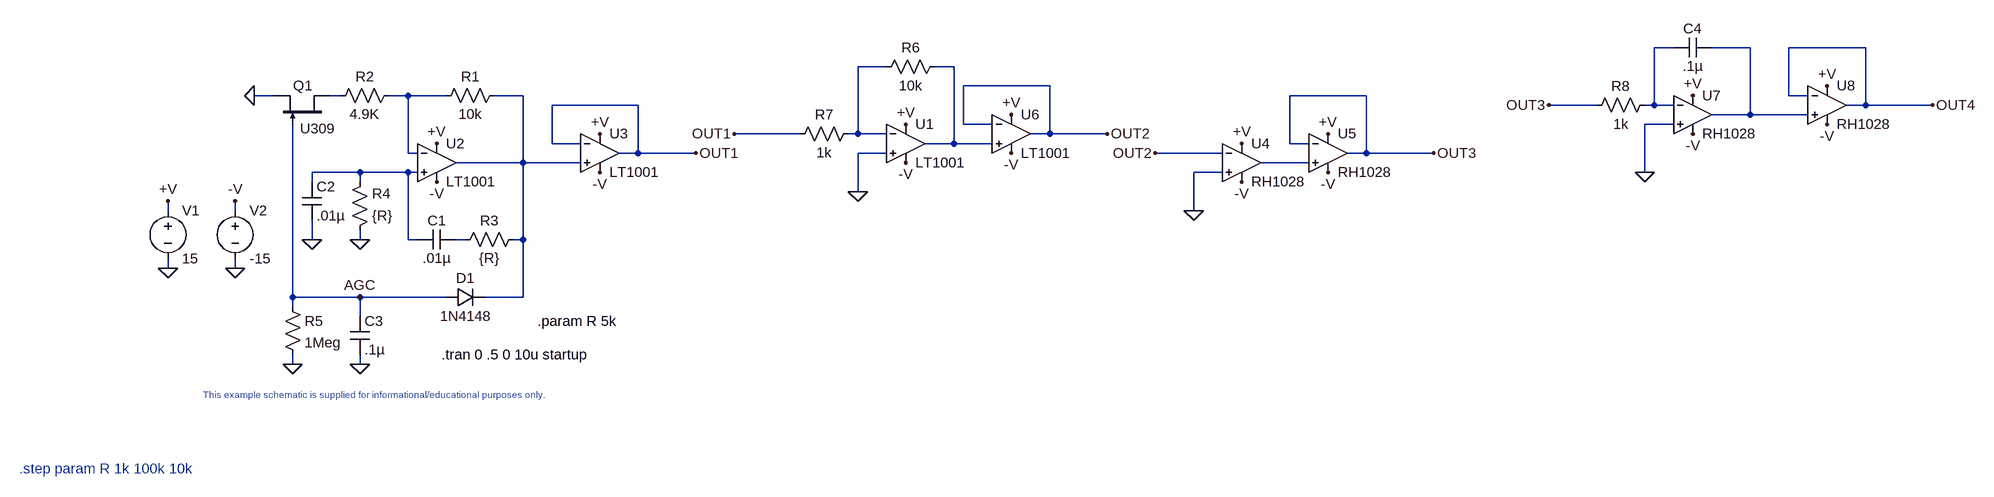
[diagram p0: schematic Puente Wien.asc]
Puente Wien.asc, the LTspice schematic file:
Version 4.1
SHEET 1 3160 1108
WIRE 2272 48 2240 48
WIRE 2400 48 2336 48
WIRE 2592 48 2464 48
WIRE 960 80 912 80
WIRE 1072 80 1040 80
WIRE 1232 112 1088 112
WIRE -112 128 -144 128
WIRE 0 128 -16 128
WIRE 112 128 80 128
WIRE 176 128 112 128
WIRE 304 128 256 128
WIRE 1760 128 1632 128
WIRE 2464 128 2464 48
WIRE 2496 128 2464 128
WIRE 496 144 352 144
WIRE 2144 144 2064 144
WIRE 2240 144 2240 48
WIRE 2240 144 2224 144
WIRE 2272 144 2240 144
WIRE 2592 144 2592 48
WIRE 2592 144 2560 144
WIRE 2704 144 2592 144
WIRE 2400 160 2400 48
WIRE 2400 160 2336 160
WIRE 2496 160 2400 160
WIRE 1088 176 1088 112
WIRE 1136 176 1088 176
WIRE 2272 176 2224 176
WIRE 816 192 656 192
WIRE 912 192 912 80
WIRE 912 192 896 192
WIRE 960 192 912 192
WIRE 1232 192 1232 112
WIRE 1232 192 1200 192
WIRE 1328 192 1232 192
WIRE 352 208 352 144
WIRE 400 208 352 208
WIRE 1072 208 1072 80
WIRE 1072 208 1024 208
WIRE 1136 208 1072 208
WIRE 1632 208 1632 128
WIRE 1664 208 1632 208
WIRE 112 224 112 128
WIRE 128 224 112 224
WIRE 496 224 496 144
WIRE 496 224 464 224
WIRE 592 224 496 224
WIRE 960 224 912 224
WIRE 1520 224 1408 224
WIRE 1760 224 1760 128
WIRE 1760 224 1728 224
WIRE 1872 224 1760 224
WIRE 304 240 304 128
WIRE 304 240 192 240
WIRE 400 240 304 240
WIRE 1664 240 1584 240
WIRE 32 256 -48 256
WIRE 112 256 32 256
WIRE 128 256 112 256
WIRE 1520 256 1472 256
WIRE 2224 256 2224 176
WIRE -48 272 -48 256
WIRE 32 272 32 256
WIRE 912 288 912 224
WIRE -288 320 -288 304
WIRE -176 320 -176 304
WIRE 1472 320 1472 256
WIRE -48 368 -48 336
WIRE 32 368 32 352
WIRE 112 368 112 256
WIRE 128 368 112 368
WIRE 208 368 192 368
WIRE 304 368 304 240
WIRE 304 368 288 368
WIRE -288 416 -288 400
WIRE -176 416 -176 400
WIRE -80 464 -80 176
WIRE 32 464 -80 464
WIRE 176 464 32 464
WIRE 304 464 304 368
WIRE 304 464 240 464
WIRE -80 480 -80 464
WIRE 32 496 32 464
WIRE -80 576 -80 560
WIRE 32 576 32 560
FLAG 160 208 +V
FLAG 160 272 -V
FLAG -288 304 +V
FLAG -176 416 0
FLAG -288 416 0
FLAG -176 304 -V
FLAG 32 368 0
FLAG -48 368 0
FLAG -144 128 0
FLAG 32 576 0
FLAG -80 576 0
FLAG 32 464 AGC
FLAG 592 224 OUT1
FLAG 432 192 +V
FLAG 432 256 -V
FLAG 992 176 +V
FLAG 992 240 -V
FLAG 656 192 OUT1
FLAG 1168 160 +V
FLAG 1168 224 -V
FLAG 1328 192 OUT2
FLAG 1408 224 OUT2
FLAG 1472 320 0
FLAG 1552 208 +V
FLAG 1552 272 -V
FLAG 1696 192 +V
FLAG 1696 256 -V
FLAG 1872 224 OUT3
FLAG 912 288 0
FLAG 2304 128 +V
FLAG 2304 192 -V
FLAG 2224 256 0
FLAG 2528 112 +V
FLAG 2528 176 -V
FLAG 2704 144 OUT4
FLAG 2064 144 OUT3
SYMBOL voltage -288 304 R0
SYMATTR InstName V1
SYMATTR Value 15
SYMBOL voltage -176 304 R0
SYMATTR InstName V2
SYMATTR Value -15
SYMBOL res 272 112 R90
WINDOW 0 0 56 VBottom 2
WINDOW 3 32 56 VTop 2
SYMATTR InstName R1
SYMATTR Value 10k
SYMBOL res 96 112 R90
WINDOW 0 0 56 VBottom 2
WINDOW 3 32 56 VTop 2
SYMATTR InstName R2
SYMATTR Value 4.9K
SYMBOL res 304 352 R90
WINDOW 0 0 56 VBottom 2
WINDOW 3 32 56 VTop 2
SYMATTR InstName R3
SYMATTR Value {R}
SYMBOL res 16 368 M180
WINDOW 0 36 76 Left 2
WINDOW 3 36 40 Left 2
SYMATTR InstName R4
SYMATTR Value {R}
SYMBOL cap 192 352 R90
WINDOW 0 0 32 VBottom 2
WINDOW 3 32 32 VTop 2
SYMATTR InstName C1
SYMATTR Value .01µ
SYMBOL cap -64 272 R0
SYMATTR InstName C2
SYMATTR Value .01µ
SYMBOL njf -16 176 M270
WINDOW 0 49 47 VTop 2
WINDOW 3 -7 52 VLeft 2
SYMATTR InstName Q1
SYMATTR Value U309
SYMBOL diode 176 448 M90
WINDOW 0 0 32 VBottom 2
WINDOW 3 32 32 VTop 2
SYMATTR InstName D1
SYMATTR Value 1N4148
SYMBOL res -96 464 R0
SYMATTR InstName R5
SYMATTR Value 1Meg
SYMBOL cap 16 560 M180
WINDOW 0 24 56 Left 2
WINDOW 3 24 8 Left 2
SYMATTR InstName C3
SYMATTR Value .1µ
SYMBOL opamps\\LT1001 160 176 R0
SYMATTR InstName U2
SYMBOL opamps\\LT1001 432 160 R0
SYMATTR InstName U3
SYMBOL opamps\\LT1001 992 144 R0
SYMATTR InstName U1
SYMBOL res 1056 64 R90
WINDOW 0 0 56 VBottom 2
WINDOW 3 32 56 VTop 2
SYMATTR InstName R6
SYMATTR Value 10k
SYMBOL res 912 176 R90
WINDOW 0 0 56 VBottom 2
WINDOW 3 32 56 VTop 2
SYMATTR InstName R7
SYMATTR Value 1k
SYMBOL opamps\\LT1001 1168 128 R0
SYMATTR InstName U6
SYMBOL OpAmps\\RH1028 1552 176 R0
SYMATTR InstName U4
SYMBOL OpAmps\\RH1028 1696 160 R0
SYMATTR InstName U5
SYMBOL cap 2272 64 R270
WINDOW 0 32 32 VTop 2
WINDOW 3 0 32 VBottom 2
SYMATTR InstName C4
SYMATTR Value .1µ
SYMBOL res 2240 128 R90
WINDOW 0 0 56 VBottom 2
WINDOW 3 32 56 VTop 2
SYMATTR InstName R8
SYMATTR Value 1k
SYMBOL OpAmps\\RH1028 2304 96 R0
SYMATTR InstName U7
SYMBOL OpAmps\\RH1028 2528 80 R0
SYMATTR InstName U8
TEXT 168 560 Left 2 !.tran 0 .5 0 10u startup
TEXT 56 616 Top 1 ;This example schematic is supplied for informational/educational purposes only.
TEXT -536 768 Left 2 ;.step param R 1k 100k 10k
TEXT 328 504 Left 2 !.param R 5k

The netlist it stands for:
* Puente Wien.asc
V1 +V 0 15
V2 -V 0 -15
R1 N007 N006 10k
R2 N006 N005 4.9K
R3 N007 N010 {R}
R4 0 N009 {R}
C1 N010 N009 .01µ
C2 N009 0 .01µ
J§Q1 N005 AGC 0 U309
D1 AGC N007 1N4148
R5 AGC 0 1Meg
C3 0 AGC .1µ
X§U2 N009 N006 +V -V N007 LT1001  ; pins In+ In- V+ V- OUT
X§U3 N007 OUT1 +V -V OUT1 LT1001  ; pins In+ In- V+ V- OUT
X§U1 0 N003 +V -V N004 LT1001  ; pins In+ In- V+ V- OUT
R6 N004 N003 10k
R7 N003 OUT1 1k
X§U6 N004 OUT2 +V -V OUT2 LT1001  ; pins In+ In- V+ V- OUT
X§U4 0 OUT2 +V -V N008 RH1028  ; pins In+ In- V+ V- OUT
X§U5 N008 OUT3 +V -V OUT3 RH1028  ; pins In+ In- V+ V- OUT
C4 N001 N002 .1µ
R8 N001 OUT3 1k
X§U7 0 N001 +V -V N002 RH1028  ; pins In+ In- V+ V- OUT
X§U8 N002 OUT4 +V -V OUT4 RH1028  ; pins In+ In- V+ V- OUT
.model D D
.lib standard.dio
.model NJF NJF
.model PJF PJF
.lib standard.jft
.tran 0 .5 0 10u startup
* This example schematic is supplied for informational/educational purposes only.
* .step param R 1k 100k 10k
.param R 5k
.lib LTC.lib
.backanno
.end